# Altium schematic sheet Power.SchDoc: Power / LDOs
size A4; Date: 23.09.2023; ApprovedBy: M.Sc. Tobias Wirth; CheckedBy: M.Sc. Tobias Wirth; Author: M.Sc. Tobias Wirth; CompanyName: University of Stuttgart; DrawnBy: M.Sc. Tobias Wirth; Engineer: M.Sc. Tobias Wirth; Organization: IIS; Address1: Pfaffenwaldring 47; Address2: 70569 Stuttgart; Revision: V1.1; SheetNumber: 1; SheetTotal: 2; ProjectNameAlt: AUS - NMR System; Time: 18:00; ImagePath: N/A; Application_BuildNumber: N/A
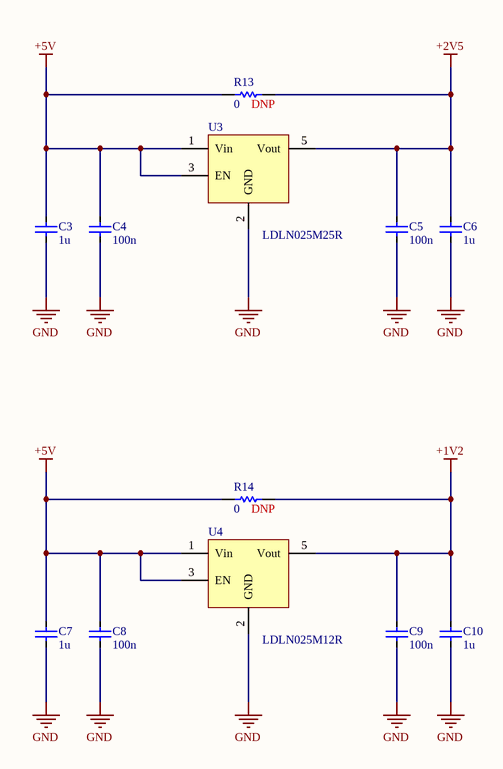
[diagram p0: Power.SchDoc]

## Parts
C3  1u  [CAP_0402]
C4  100n  [CAP_0402]
C5  100n  [CAP_0402]
C6  1u  [CAP_0402]
C7  1u  [CAP_0402]
C8  100n  [CAP_0402]
C9  100n  [CAP_0402]
C10  1u  [CAP_0402]
R13  0  Note: DNP  [RES_0402]
R14  0  Note: DNP  [RES_0402]
U3  LDLN025M25R  [SOT23-95P280X145-5N]
U4  LDLN025M12R  [SOT23-95P280X145-5N]

## Nets
+1V2: C9.1 C10.1 R14.2 U4.5(Vout)
+2V5: C5.1 C6.1 R13.2 U3.5(Vout)
+5V: C3.1 C4.1 C7.1 C8.1 R13.1 R14.1 U3.1(Vin) U3.3(EN) U4.1(Vin) U4.3(EN)
GND: C3.2 C4.2 C5.2 C6.2 C7.2 C8.2 C9.2 C10.2 U3.2(GND) U4.2(GND)

## Notes on the sheet
- Title
- Size
- Date:
- Sheet
- A4
- of
- Project
- Drawn By:
- Revision:

## Library data of the parts
C3-C10 = Cap: Supplier: *; Part Number: *
  C3 C6 C7 C10: Value: 1u
  C4 C5 C8 C9: Value: 100n
R13 R14 = Res: Part Number: *; Supplier: *; Value: 0
U3 U4 = LDLN025MxxR